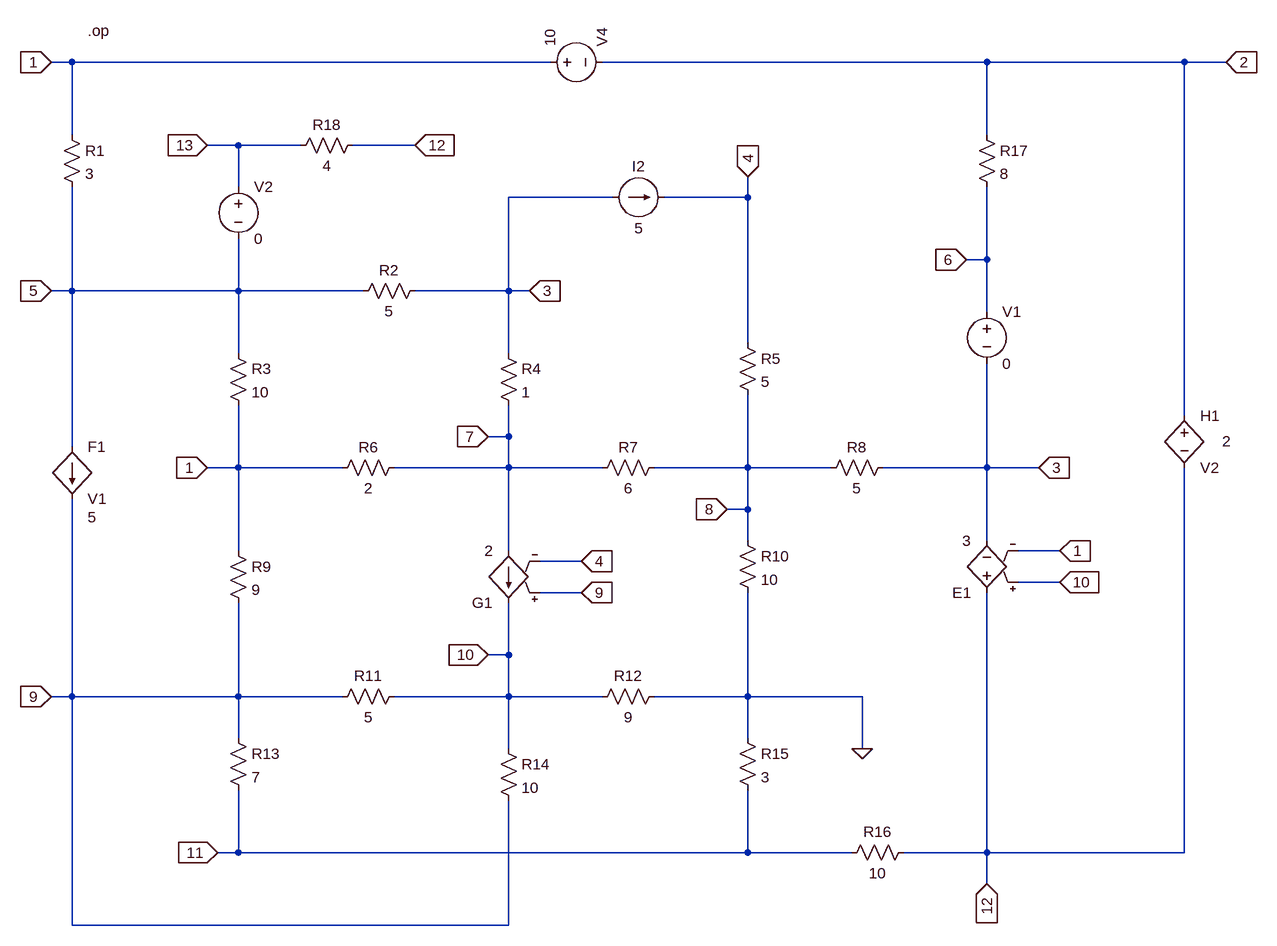
[diagram p0: schematic test_4.asc]
test_4.asc, the LTspice schematic file:
Version 4
SHEET 1 2008 704
WIRE 96 -1424 64 -1424
WIRE 832 -1424 96 -1424
WIRE 1504 -1424 912 -1424
WIRE 1808 -1424 1504 -1424
WIRE 1872 -1424 1808 -1424
WIRE 96 -1312 96 -1424
WIRE 1504 -1312 1504 -1424
WIRE 352 -1296 304 -1296
WIRE 448 -1296 352 -1296
WIRE 624 -1296 528 -1296
WIRE 352 -1232 352 -1296
WIRE 928 -1216 768 -1216
WIRE 1136 -1216 1136 -1248
WIRE 1136 -1216 1008 -1216
WIRE 1504 -1120 1504 -1232
WIRE 1504 -1120 1472 -1120
WIRE 96 -1072 96 -1232
WIRE 96 -1072 64 -1072
WIRE 352 -1072 352 -1152
WIRE 352 -1072 96 -1072
WIRE 544 -1072 352 -1072
WIRE 768 -1072 768 -1216
WIRE 768 -1072 624 -1072
WIRE 800 -1072 768 -1072
WIRE 1504 -1040 1504 -1120
WIRE 1136 -992 1136 -1216
WIRE 352 -976 352 -1072
WIRE 768 -976 768 -1072
WIRE 1808 -880 1808 -1424
WIRE 768 -848 768 -896
WIRE 768 -848 736 -848
WIRE 96 -832 96 -1072
WIRE 352 -800 352 -896
WIRE 352 -800 304 -800
WIRE 512 -800 352 -800
WIRE 768 -800 768 -848
WIRE 768 -800 592 -800
WIRE 912 -800 768 -800
WIRE 1136 -800 1136 -912
WIRE 1136 -800 992 -800
WIRE 1264 -800 1136 -800
WIRE 1504 -800 1504 -960
WIRE 1504 -800 1344 -800
WIRE 1584 -800 1504 -800
WIRE 1136 -736 1136 -800
WIRE 1136 -736 1104 -736
WIRE 1136 -688 1136 -736
WIRE 1504 -688 1504 -800
WIRE 352 -672 352 -800
WIRE 768 -672 768 -800
WIRE 1616 -672 1552 -672
WIRE 880 -656 816 -656
WIRE 1616 -624 1552 -624
WIRE 880 -608 816 -608
WIRE 768 -512 768 -592
WIRE 768 -512 736 -512
WIRE 96 -448 96 -752
WIRE 96 -448 64 -448
WIRE 352 -448 352 -592
WIRE 352 -448 96 -448
WIRE 512 -448 352 -448
WIRE 768 -448 768 -512
WIRE 768 -448 592 -448
WIRE 912 -448 768 -448
WIRE 1136 -448 1136 -608
WIRE 1136 -448 992 -448
WIRE 1312 -448 1136 -448
WIRE 352 -384 352 -448
WIRE 1136 -384 1136 -448
WIRE 768 -368 768 -448
WIRE 1312 -368 1312 -448
WIRE 352 -208 352 -304
WIRE 352 -208 320 -208
WIRE 1136 -208 1136 -304
WIRE 1136 -208 352 -208
WIRE 1296 -208 1136 -208
WIRE 1504 -208 1504 -608
WIRE 1504 -208 1376 -208
WIRE 1808 -208 1808 -800
WIRE 1808 -208 1504 -208
WIRE 1504 -160 1504 -208
WIRE 96 -96 96 -448
WIRE 768 -96 768 -288
WIRE 768 -96 96 -96
FLAG 1312 -368 0
FLAG 880 -656 4
IOPIN 880 -656 In
FLAG 880 -608 9
IOPIN 880 -608 In
FLAG 1616 -624 10
IOPIN 1616 -624 In
FLAG 1616 -672 1
IOPIN 1616 -672 In
FLAG 1504 -160 12
IOPIN 1504 -160 In
FLAG 1136 -1248 4
IOPIN 1136 -1248 In
FLAG 800 -1072 3
IOPIN 800 -1072 In
FLAG 64 -1424 1
IOPIN 64 -1424 In
FLAG 64 -448 9
IOPIN 64 -448 In
FLAG 736 -512 10
IOPIN 736 -512 In
FLAG 304 -800 1
IOPIN 304 -800 In
FLAG 736 -848 7
IOPIN 736 -848 In
FLAG 1104 -736 8
IOPIN 1104 -736 In
FLAG 1584 -800 3
IOPIN 1584 -800 In
FLAG 1872 -1424 2
IOPIN 1872 -1424 In
FLAG 320 -208 11
IOPIN 320 -208 In
FLAG 64 -1072 5
IOPIN 64 -1072 In
FLAG 624 -1296 12
IOPIN 624 -1296 In
FLAG 1472 -1120 6
IOPIN 1472 -1120 In
FLAG 304 -1296 13
IOPIN 304 -1296 In
SYMBOL voltage 816 -1424 R270
WINDOW 0 24 96 Left 2
WINDOW 3 24 16 Left 2
WINDOW 123 0 0 Left 2
WINDOW 39 0 0 Left 2
SYMATTR InstName V4
SYMATTR Value 10
SYMBOL current 928 -1216 R270
WINDOW 0 32 40 VTop 2
WINDOW 3 -32 40 VBottom 2
WINDOW 123 0 0 Left 2
WINDOW 39 0 0 Left 2
SYMATTR InstName I2
SYMATTR Value 5
SYMBOL f 96 -832 R0
WINDOW 123 24 108 Left 2
SYMATTR Value2 5
SYMATTR InstName F1
SYMATTR Value V1
SYMBOL e 1504 -592 R180
SYMATTR InstName E1
SYMATTR Value 3
SYMBOL g 768 -576 R180
SYMATTR InstName G1
SYMATTR Value 2
SYMBOL h 1808 -896 R0
WINDOW 123 58 55 Left 2
SYMATTR Value2 2
SYMATTR InstName H1
SYMATTR Value V2
SYMBOL res 336 -992 R0
SYMATTR InstName R3
SYMATTR Value 10
SYMBOL res 752 -992 R0
SYMATTR InstName R4
SYMATTR Value 1
SYMBOL res 1120 -1008 R0
SYMATTR InstName R5
SYMATTR Value 5
SYMBOL res 336 -688 R0
SYMATTR InstName R9
SYMATTR Value 9
SYMBOL res 80 -1328 R0
SYMATTR InstName R1
SYMATTR Value 3
SYMBOL res 1120 -704 R0
SYMATTR InstName R10
SYMATTR Value 10
SYMBOL res 336 -400 R0
SYMATTR InstName R13
SYMATTR Value 7
SYMBOL res 752 -384 R0
SYMATTR InstName R14
SYMATTR Value 10
SYMBOL res 1120 -400 R0
SYMATTR InstName R15
SYMATTR Value 3
SYMBOL res 640 -1088 R90
WINDOW 0 0 56 VBottom 2
WINDOW 3 32 56 VTop 2
SYMATTR InstName R2
SYMATTR Value 5
SYMBOL res 608 -816 R90
WINDOW 0 0 56 VBottom 2
WINDOW 3 32 56 VTop 2
SYMATTR InstName R6
SYMATTR Value 2
SYMBOL res 1008 -816 R90
WINDOW 0 0 56 VBottom 2
WINDOW 3 32 56 VTop 2
SYMATTR InstName R7
SYMATTR Value 6
SYMBOL res 608 -464 R90
WINDOW 0 0 56 VBottom 2
WINDOW 3 32 56 VTop 2
SYMATTR InstName R11
SYMATTR Value 5
SYMBOL res 1008 -464 R90
WINDOW 0 0 56 VBottom 2
WINDOW 3 32 56 VTop 2
SYMATTR InstName R12
SYMATTR Value 9
SYMBOL res 1392 -224 R90
WINDOW 0 0 56 VBottom 2
WINDOW 3 32 56 VTop 2
SYMATTR InstName R16
SYMATTR Value 10
SYMBOL res 1360 -816 R90
WINDOW 0 0 56 VBottom 2
WINDOW 3 32 56 VTop 2
SYMATTR InstName R8
SYMATTR Value 5
SYMBOL res 1488 -1328 R0
SYMATTR InstName R17
SYMATTR Value 8
SYMBOL voltage 1504 -1056 R0
WINDOW 123 0 0 Left 0
WINDOW 39 0 0 Left 0
SYMATTR InstName V1
SYMATTR Value 0
SYMBOL voltage 352 -1248 R0
WINDOW 123 0 0 Left 0
WINDOW 39 0 0 Left 0
SYMATTR InstName V2
SYMATTR Value 0
SYMBOL res 544 -1312 R90
WINDOW 0 0 56 VBottom 2
WINDOW 3 32 56 VTop 2
SYMATTR InstName R18
SYMATTR Value 4
TEXT 120 -1472 Left 2 !.op

The netlist it stands for:
* test_4.asc
V4 1 2 10
I2 3 4 5
F1 5 9 V1 5
E1 12 3 10 1 3
G1 7 10 9 4 2
H1 2 12 V2 2
R3 5 1 10
R4 3 7 1
R5 4 8 5
R9 1 9 9
R1 1 5 3
R10 8 0 10
R13 9 11 7
R14 10 9 10
R15 0 11 3
R2 3 5 5
R6 7 1 2
R7 8 7 6
R11 10 9 5
R12 0 10 9
R16 12 11 10
R8 3 8 5
R17 2 6 8
V1 6 3 0
V2 13 5 0
R18 12 13 4
.op
.backanno
.end